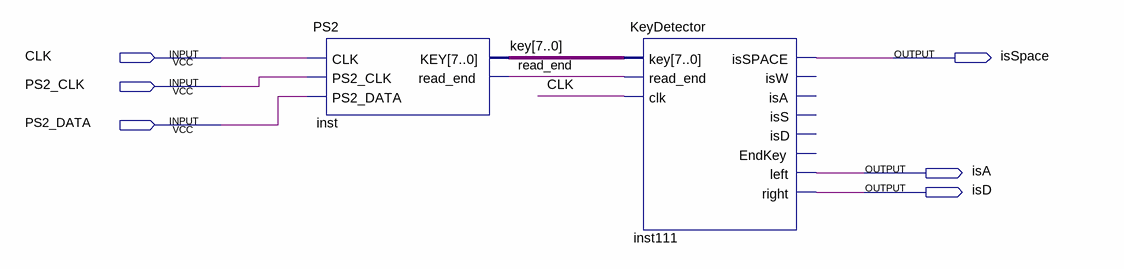
[diagram p0: schematic sheet]
// Quartus schematic MainTast.bdf as structural Verilog: 2 symbols, 6 pins
module MainTast (
  input  CLK,
  input  PS2_CLK,
  input  PS2_DATA,
  output isSpace,
  output isA,
  output isD
);

  wire read_end;
  wire [7:0] key;

  PS2 inst (.CLK(CLK), .PS2_CLK(PS2_CLK), .PS2_DATA(PS2_DATA), .KEY(key), .read_end(read_end));
  KeyDetector inst111 (
    .key(key), .read_end(read_end), .clk(CLK), .isSPACE(isSpace), .left(isA), .right(isD));  // open: isW, isA, isS, isD, EndKey
endmodule
